# EAGLE design Cube_Mini_8x8x8_LED_Grid_08 (EAGLE 9.6.2)
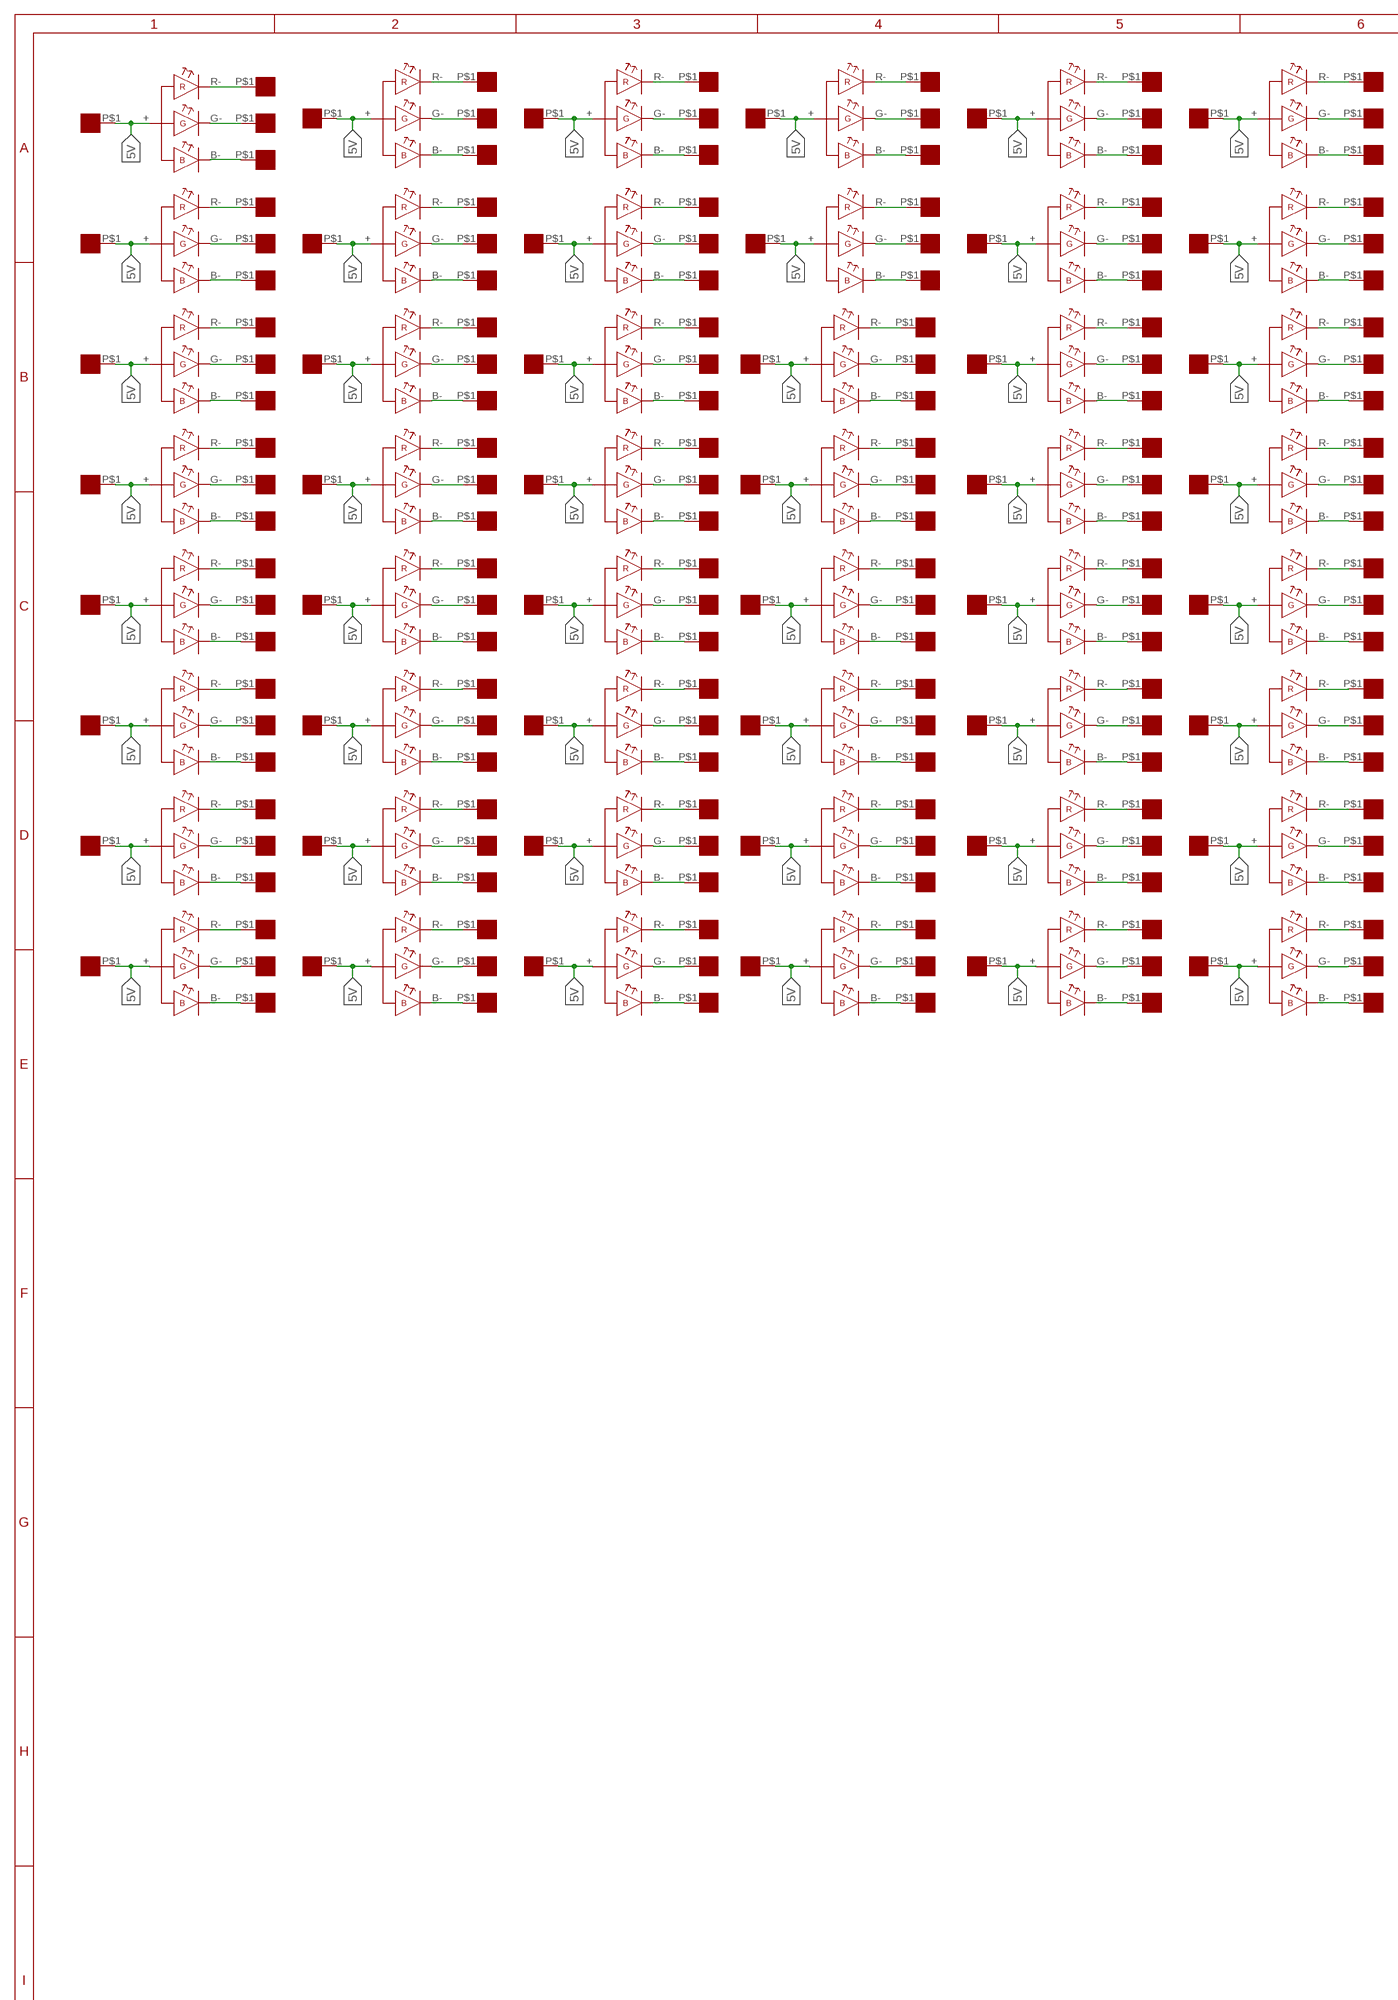
[diagram p0: schematic, sheet 1, part 1 of 2]
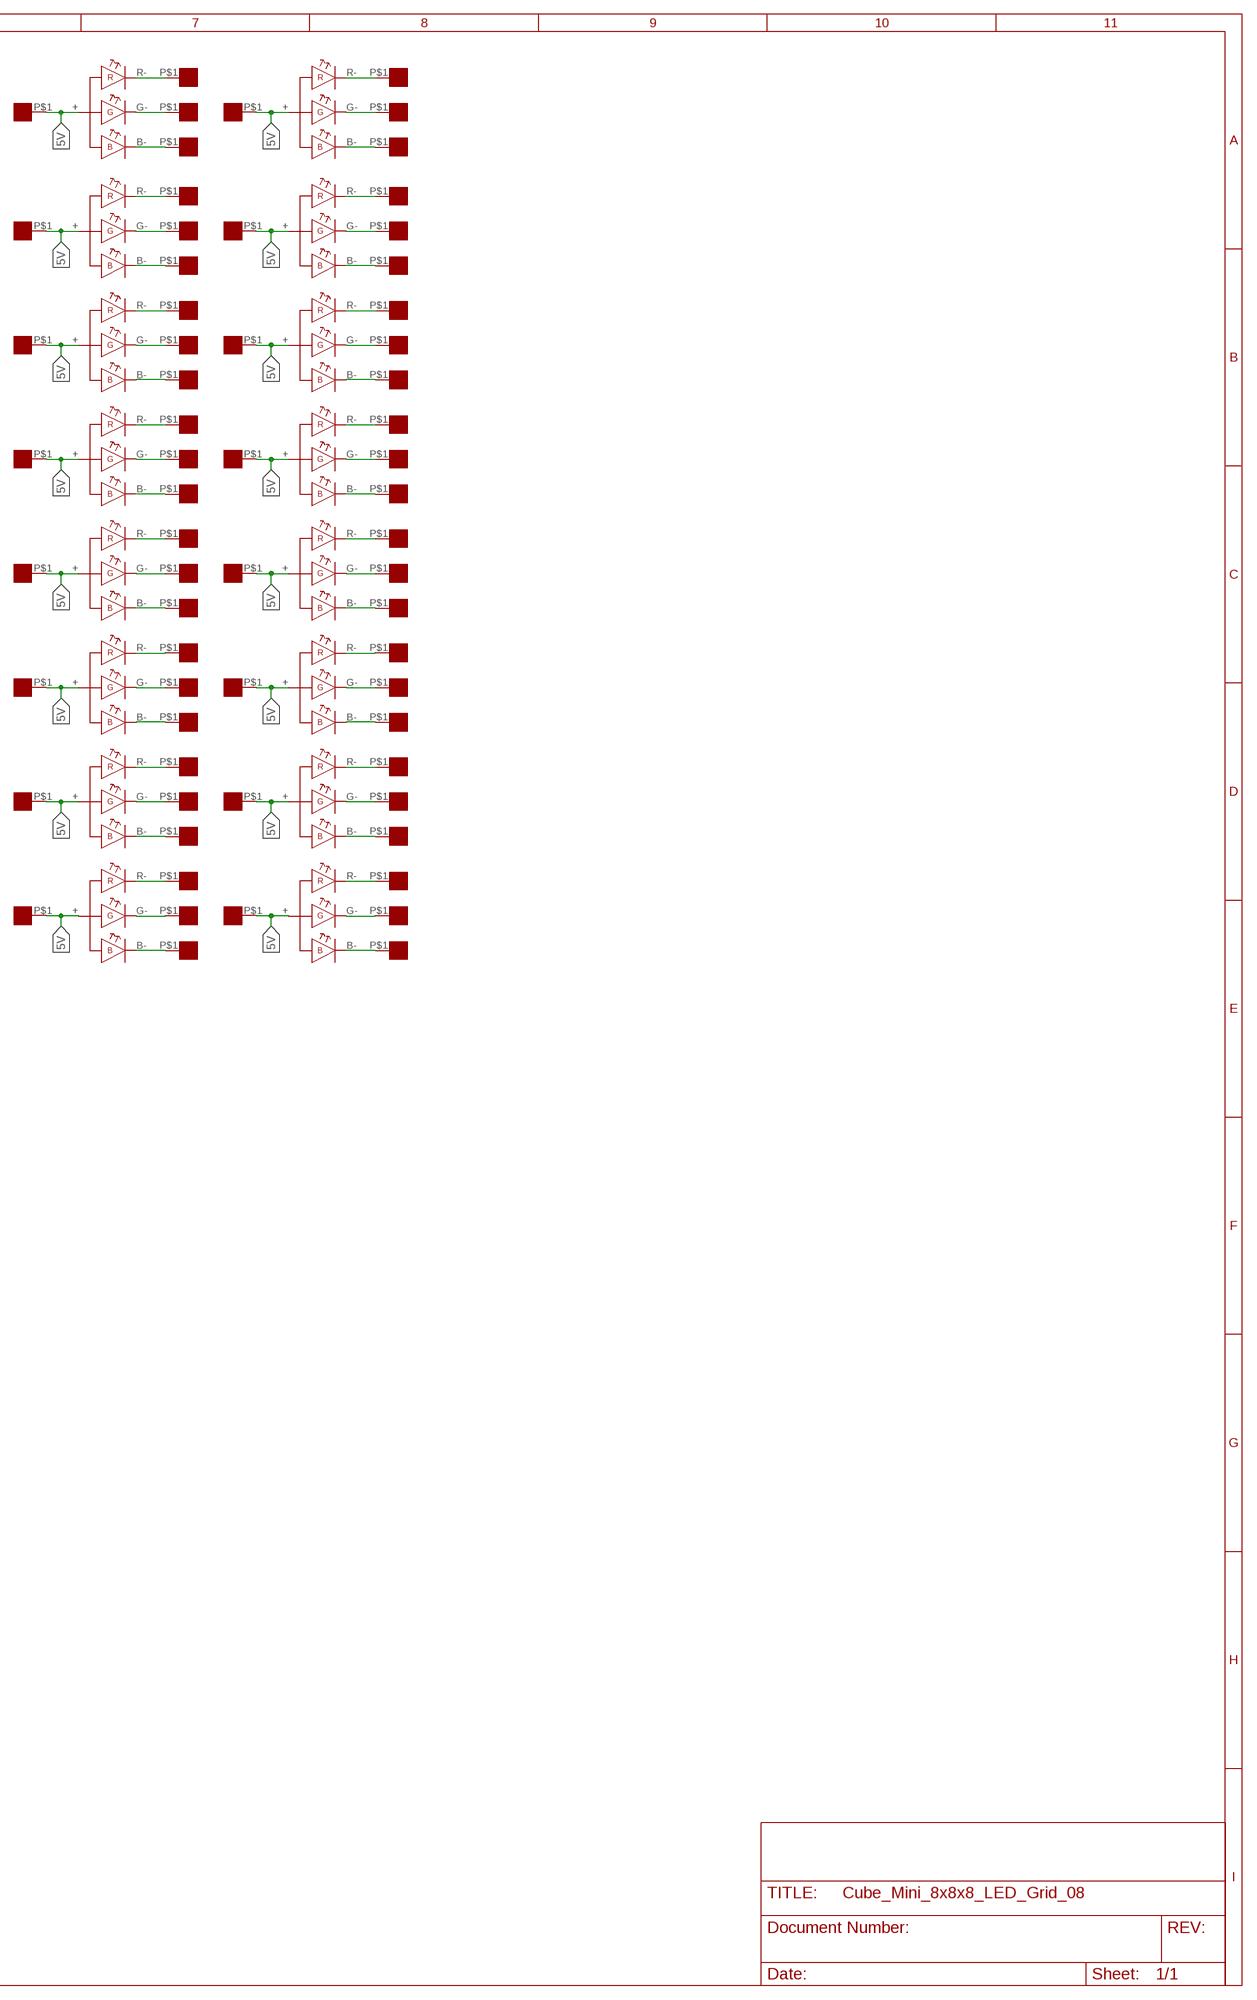
[diagram p1: schematic, sheet 1, part 2 of 2]

## Parts
5V$1  05X08PAD  [05X08PAD]
5V$2  05X08PAD  [05X08PAD]
5V$3  05X08PAD  [05X08PAD]
5V$4  05X08PAD  [05X08PAD]
5V$5  05X08PAD  [05X08PAD]
5V$6  05X08PAD  [05X08PAD]
5V$7  05X08PAD  [05X08PAD]
5V$8  05X08PAD  [05X08PAD]
5V$9  05X08PAD  [05X08PAD]
5V$10  05X08PAD  [05X08PAD]
5V$11  05X08PAD  [05X08PAD]
5V$12  05X08PAD  [05X08PAD]
5V$13  05X08PAD  [05X08PAD]
5V$14  05X08PAD  [05X08PAD]
5V$15  05X08PAD  [05X08PAD]
5V$16  05X08PAD  [05X08PAD]
5V$17  05X08PAD  [05X08PAD]
5V$18  05X08PAD  [05X08PAD]
5V$19  05X08PAD  [05X08PAD]
5V$20  05X08PAD  [05X08PAD]
5V$21  05X08PAD  [05X08PAD]
5V$22  05X08PAD  [05X08PAD]
5V$23  05X08PAD  [05X08PAD]
5V$24  05X08PAD  [05X08PAD]
5V$25  05X08PAD  [05X08PAD]
5V$26  05X08PAD  [05X08PAD]
5V$27  05X08PAD  [05X08PAD]
5V$28  05X08PAD  [05X08PAD]
5V$29  05X08PAD  [05X08PAD]
5V$30  05X08PAD  [05X08PAD]
5V$31  05X08PAD  [05X08PAD]
5V$32  05X08PAD  [05X08PAD]
5V$33  05X08PAD  [05X08PAD]
5V$34  05X08PAD  [05X08PAD]
5V$35  05X08PAD  [05X08PAD]
5V$36  05X08PAD  [05X08PAD]
5V$37  05X08PAD  [05X08PAD]
5V$38  05X08PAD  [05X08PAD]
5V$39  05X08PAD  [05X08PAD]
5V$40  05X08PAD  [05X08PAD]
5V$41  05X08PAD  [05X08PAD]
5V$42  05X08PAD  [05X08PAD]
5V$43  05X08PAD  [05X08PAD]
5V$44  05X08PAD  [05X08PAD]
5V$45  05X08PAD  [05X08PAD]
5V$46  05X08PAD  [05X08PAD]
5V$47  05X08PAD  [05X08PAD]
5V$48  05X08PAD  [05X08PAD]
5V$49  05X08PAD  [05X08PAD]
5V$50  05X08PAD  [05X08PAD]
5V$51  05X08PAD  [05X08PAD]
5V$52  05X08PAD  [05X08PAD]
5V$53  05X08PAD  [05X08PAD]
5V$54  05X08PAD  [05X08PAD]
5V$55  05X08PAD  [05X08PAD]
5V$56  05X08PAD  [05X08PAD]
5V$57  05X08PAD  [05X08PAD]
5V$58  05X08PAD  [05X08PAD]
5V$59  05X08PAD  [05X08PAD]
5V$60  05X08PAD  [05X08PAD]
5V$61  05X08PAD  [05X08PAD]
5V$62  05X08PAD  [05X08PAD]
5V$63  05X08PAD  [05X08PAD]
5V$64  05X08PAD  [05X08PAD]
B$1  05X08PAD  [05X08PAD]
B$2  05X08PAD  [05X08PAD]
B$3  05X08PAD  [05X08PAD]
B$4  05X08PAD  [05X08PAD]
B$5  05X08PAD  [05X08PAD]
B$6  05X08PAD  [05X08PAD]
B$7  05X08PAD  [05X08PAD]
B$8  05X08PAD  [05X08PAD]
B$9  05X08PAD  [05X08PAD]
B$10  05X08PAD  [05X08PAD]
B$11  05X08PAD  [05X08PAD]
B$12  05X08PAD  [05X08PAD]
B$13  05X08PAD  [05X08PAD]
B$14  05X08PAD  [05X08PAD]
B$15  05X08PAD  [05X08PAD]
B$16  05X08PAD  [05X08PAD]
B$17  05X08PAD  [05X08PAD]
B$18  05X08PAD  [05X08PAD]
B$19  05X08PAD  [05X08PAD]
B$20  05X08PAD  [05X08PAD]
B$21  05X08PAD  [05X08PAD]
B$22  05X08PAD  [05X08PAD]
B$23  05X08PAD  [05X08PAD]
B$24  05X08PAD  [05X08PAD]
B$25  05X08PAD  [05X08PAD]
B$26  05X08PAD  [05X08PAD]
B$27  05X08PAD  [05X08PAD]
B$28  05X08PAD  [05X08PAD]
B$29  05X08PAD  [05X08PAD]
B$30  05X08PAD  [05X08PAD]
B$31  05X08PAD  [05X08PAD]
B$32  05X08PAD  [05X08PAD]
B$33  05X08PAD  [05X08PAD]
B$34  05X08PAD  [05X08PAD]
B$35  05X08PAD  [05X08PAD]
B$36  05X08PAD  [05X08PAD]
B$37  05X08PAD  [05X08PAD]
B$38  05X08PAD  [05X08PAD]
B$39  05X08PAD  [05X08PAD]
B$40  05X08PAD  [05X08PAD]
B$41  05X08PAD  [05X08PAD]
B$42  05X08PAD  [05X08PAD]
B$43  05X08PAD  [05X08PAD]
B$44  05X08PAD  [05X08PAD]
B$45  05X08PAD  [05X08PAD]
B$46  05X08PAD  [05X08PAD]
B$47  05X08PAD  [05X08PAD]
B$48  05X08PAD  [05X08PAD]
B$49  05X08PAD  [05X08PAD]
B$50  05X08PAD  [05X08PAD]
B$51  05X08PAD  [05X08PAD]
B$52  05X08PAD  [05X08PAD]
B$53  05X08PAD  [05X08PAD]
B$54  05X08PAD  [05X08PAD]
B$55  05X08PAD  [05X08PAD]
B$56  05X08PAD  [05X08PAD]
B$57  05X08PAD  [05X08PAD]
B$58  05X08PAD  [05X08PAD]
B$59  05X08PAD  [05X08PAD]
B$60  05X08PAD  [05X08PAD]
B$61  05X08PAD  [05X08PAD]
B$62  05X08PAD  [05X08PAD]
B$63  05X08PAD  [05X08PAD]
B$64  05X08PAD  [05X08PAD]
G$1  05X08PAD  [05X08PAD]
G$2  05X08PAD  [05X08PAD]
G$3  05X08PAD  [05X08PAD]
G$4  05X08PAD  [05X08PAD]
G$5  05X08PAD  [05X08PAD]
G$6  05X08PAD  [05X08PAD]
G$7  05X08PAD  [05X08PAD]
G$8  05X08PAD  [05X08PAD]
G$9  05X08PAD  [05X08PAD]
G$10  05X08PAD  [05X08PAD]
G$11  05X08PAD  [05X08PAD]
G$12  05X08PAD  [05X08PAD]
G$13  05X08PAD  [05X08PAD]
G$14  05X08PAD  [05X08PAD]
G$15  05X08PAD  [05X08PAD]
G$16  05X08PAD  [05X08PAD]
G$17  05X08PAD  [05X08PAD]
G$18  05X08PAD  [05X08PAD]
G$19  05X08PAD  [05X08PAD]
G$20  05X08PAD  [05X08PAD]
G$21  05X08PAD  [05X08PAD]
G$22  05X08PAD  [05X08PAD]
G$23  05X08PAD  [05X08PAD]
G$24  05X08PAD  [05X08PAD]
G$25  05X08PAD  [05X08PAD]
G$26  05X08PAD  [05X08PAD]
G$27  05X08PAD  [05X08PAD]
G$28  05X08PAD  [05X08PAD]
G$29  05X08PAD  [05X08PAD]
G$30  05X08PAD  [05X08PAD]
G$31  05X08PAD  [05X08PAD]
G$32  05X08PAD  [05X08PAD]
G$33  05X08PAD  [05X08PAD]
G$34  05X08PAD  [05X08PAD]
G$35  05X08PAD  [05X08PAD]
G$36  05X08PAD  [05X08PAD]
G$37  05X08PAD  [05X08PAD]
G$38  05X08PAD  [05X08PAD]
G$39  05X08PAD  [05X08PAD]
G$40  05X08PAD  [05X08PAD]
G$41  05X08PAD  [05X08PAD]
G$42  05X08PAD  [05X08PAD]
G$43  05X08PAD  [05X08PAD]
G$44  05X08PAD  [05X08PAD]
G$45  05X08PAD  [05X08PAD]
G$46  05X08PAD  [05X08PAD]
G$47  05X08PAD  [05X08PAD]
G$48  05X08PAD  [05X08PAD]
G$49  05X08PAD  [05X08PAD]
G$50  05X08PAD  [05X08PAD]
G$51  05X08PAD  [05X08PAD]
G$52  05X08PAD  [05X08PAD]
G$53  05X08PAD  [05X08PAD]
G$54  05X08PAD  [05X08PAD]
G$55  05X08PAD  [05X08PAD]
G$56  05X08PAD  [05X08PAD]
G$57  05X08PAD  [05X08PAD]
G$58  05X08PAD  [05X08PAD]
G$59  05X08PAD  [05X08PAD]
G$60  05X08PAD  [05X08PAD]
G$61  05X08PAD  [05X08PAD]
G$62  05X08PAD  [05X08PAD]
G$63  05X08PAD  [05X08PAD]
G$64  05X08PAD  [05X08PAD]
R$1  05X08PAD  [05X08PAD]
R$2  05X08PAD  [05X08PAD]
R$3  05X08PAD  [05X08PAD]
R$4  05X08PAD  [05X08PAD]
R$5  05X08PAD  [05X08PAD]
R$6  05X08PAD  [05X08PAD]
R$7  05X08PAD  [05X08PAD]
R$8  05X08PAD  [05X08PAD]
R$9  05X08PAD  [05X08PAD]
R$10  05X08PAD  [05X08PAD]
R$11  05X08PAD  [05X08PAD]
R$12  05X08PAD  [05X08PAD]
R$13  05X08PAD  [05X08PAD]
R$14  05X08PAD  [05X08PAD]
R$15  05X08PAD  [05X08PAD]
R$16  05X08PAD  [05X08PAD]
R$17  05X08PAD  [05X08PAD]
R$18  05X08PAD  [05X08PAD]
R$19  05X08PAD  [05X08PAD]
R$20  05X08PAD  [05X08PAD]
R$21  05X08PAD  [05X08PAD]
R$22  05X08PAD  [05X08PAD]
R$23  05X08PAD  [05X08PAD]
R$24  05X08PAD  [05X08PAD]
R$25  05X08PAD  [05X08PAD]
R$26  05X08PAD  [05X08PAD]
R$27  05X08PAD  [05X08PAD]
R$28  05X08PAD  [05X08PAD]
R$29  05X08PAD  [05X08PAD]
R$30  05X08PAD  [05X08PAD]
R$31  05X08PAD  [05X08PAD]
R$32  05X08PAD  [05X08PAD]
R$33  05X08PAD  [05X08PAD]
R$34  05X08PAD  [05X08PAD]
R$35  05X08PAD  [05X08PAD]
R$36  05X08PAD  [05X08PAD]
R$37  05X08PAD  [05X08PAD]
R$38  05X08PAD  [05X08PAD]
R$39  05X08PAD  [05X08PAD]
R$40  05X08PAD  [05X08PAD]
R$41  05X08PAD  [05X08PAD]
R$42  05X08PAD  [05X08PAD]
R$43  05X08PAD  [05X08PAD]
R$44  05X08PAD  [05X08PAD]
R$45  05X08PAD  [05X08PAD]
R$46  05X08PAD  [05X08PAD]
R$47  05X08PAD  [05X08PAD]
R$48  05X08PAD  [05X08PAD]
R$49  05X08PAD  [05X08PAD]
R$50  05X08PAD  [05X08PAD]
R$51  05X08PAD  [05X08PAD]
R$52  05X08PAD  [05X08PAD]
R$53  05X08PAD  [05X08PAD]
R$54  05X08PAD  [05X08PAD]
R$55  05X08PAD  [05X08PAD]
R$56  05X08PAD  [05X08PAD]
R$57  05X08PAD  [05X08PAD]
R$58  05X08PAD  [05X08PAD]
R$59  05X08PAD  [05X08PAD]
R$60  05X08PAD  [05X08PAD]
R$61  05X08PAD  [05X08PAD]
R$62  05X08PAD  [05X08PAD]
R$63  05X08PAD  [05X08PAD]
R$64  05X08PAD  [05X08PAD]
U$1  B1010RGBT  [B1010RGBT]
U$2  B1010RGBT  [B1010RGBT]
U$3  B1010RGBT  [B1010RGBT]
U$4  B1010RGBT  [B1010RGBT]
U$5  B1010RGBT  [B1010RGBT]
U$6  B1010RGBT  [B1010RGBT]
U$7  B1010RGBT  [B1010RGBT]
U$8  B1010RGBT  [B1010RGBT]
U$9  B1010RGBT  [B1010RGBT]
U$10  B1010RGBT  [B1010RGBT]
U$11  B1010RGBT  [B1010RGBT]
U$12  B1010RGBT  [B1010RGBT]
U$13  B1010RGBT  [B1010RGBT]
U$14  B1010RGBT  [B1010RGBT]
U$15  B1010RGBT  [B1010RGBT]
U$16  B1010RGBT  [B1010RGBT]
U$17  B1010RGBT  [B1010RGBT]
U$18  B1010RGBT  [B1010RGBT]
U$19  B1010RGBT  [B1010RGBT]
U$20  B1010RGBT  [B1010RGBT]
U$21  B1010RGBT  [B1010RGBT]
U$22  B1010RGBT  [B1010RGBT]
U$23  B1010RGBT  [B1010RGBT]
U$24  B1010RGBT  [B1010RGBT]
U$25  B1010RGBT  [B1010RGBT]
U$26  B1010RGBT  [B1010RGBT]
U$27  B1010RGBT  [B1010RGBT]
U$28  B1010RGBT  [B1010RGBT]
U$29  B1010RGBT  [B1010RGBT]
U$30  B1010RGBT  [B1010RGBT]
U$31  B1010RGBT  [B1010RGBT]
U$32  B1010RGBT  [B1010RGBT]
U$33  B1010RGBT  [B1010RGBT]
U$34  B1010RGBT  [B1010RGBT]
U$35  B1010RGBT  [B1010RGBT]
U$36  B1010RGBT  [B1010RGBT]
U$37  B1010RGBT  [B1010RGBT]
U$38  B1010RGBT  [B1010RGBT]
U$39  B1010RGBT  [B1010RGBT]
U$40  B1010RGBT  [B1010RGBT]
U$41  B1010RGBT  [B1010RGBT]
U$42  B1010RGBT  [B1010RGBT]
U$43  B1010RGBT  [B1010RGBT]
U$44  B1010RGBT  [B1010RGBT]
U$45  B1010RGBT  [B1010RGBT]
U$46  B1010RGBT  [B1010RGBT]
U$47  B1010RGBT  [B1010RGBT]
U$48  B1010RGBT  [B1010RGBT]
U$49  B1010RGBT  [B1010RGBT]
U$50  B1010RGBT  [B1010RGBT]
U$51  B1010RGBT  [B1010RGBT]
U$52  B1010RGBT  [B1010RGBT]
U$53  B1010RGBT  [B1010RGBT]
U$54  B1010RGBT  [B1010RGBT]
U$55  B1010RGBT  [B1010RGBT]
U$56  B1010RGBT  [B1010RGBT]
U$57  B1010RGBT  [B1010RGBT]
U$58  B1010RGBT  [B1010RGBT]
U$59  B1010RGBT  [B1010RGBT]
U$60  B1010RGBT  [B1010RGBT]
U$61  B1010RGBT  [B1010RGBT]
U$62  B1010RGBT  [B1010RGBT]
U$63  B1010RGBT  [B1010RGBT]
U$64  B1010RGBT  [B1010RGBT]

## Nets
5V: 5V$1.P$1 5V$2.P$1 5V$3.P$1 5V$4.P$1 5V$5.P$1 5V$6.P$1 5V$7.P$1 5V$8.P$1 5V$9.P$1 5V$10.P$1 5V$11.P$1 5V$12.P$1 5V$13.P$1 5V$14.P$1 5V$15.P$1 5V$16.P$1 5V$17.P$1 5V$18.P$1 5V$19.P$1 5V$20.P$1 5V$21.P$1 5V$22.P$1 5V$23.P$1 5V$24.P$1 5V$25.P$1 5V$26.P$1 5V$27.P$1 5V$28.P$1 5V$29.P$1 5V$30.P$1 5V$31.P$1 5V$32.P$1 5V$33.P$1 5V$34.P$1 5V$35.P$1 5V$36.P$1 5V$37.P$1 5V$38.P$1 5V$39.P$1 5V$40.P$1 5V$41.P$1 5V$42.P$1 5V$43.P$1 5V$44.P$1 5V$45.P$1 5V$46.P$1 5V$47.P$1 5V$48.P$1 5V$49.P$1 5V$50.P$1 5V$51.P$1 5V$52.P$1 5V$53.P$1 5V$54.P$1 5V$55.P$1 5V$56.P$1 5V$57.P$1 5V$58.P$1 5V$59.P$1 5V$60.P$1 5V$61.P$1 5V$62.P$1 5V$63.P$1 5V$64.P$1 U$1.+ U$2.+ U$3.+ U$4.+ U$5.+ U$6.+ U$7.+ U$8.+ U$9.+ U$10.+ U$11.+ U$12.+ U$13.+ U$14.+ U$15.+ U$16.+ U$17.+ U$18.+ U$19.+ U$20.+ U$21.+ U$22.+ U$23.+ U$24.+ U$25.+ U$26.+ U$27.+ U$28.+ U$29.+ U$30.+ U$31.+ U$32.+ U$33.+ U$34.+ U$35.+ U$36.+ U$37.+ U$38.+ U$39.+ U$40.+ U$41.+ U$42.+ U$43.+ U$44.+ U$45.+ U$46.+ U$47.+ U$48.+ U$49.+ U$50.+ U$51.+ U$52.+ U$53.+ U$54.+ U$55.+ U$56.+ U$57.+ U$58.+ U$59.+ U$60.+ U$61.+ U$62.+ U$63.+ U$64.+
N$1: R$1.P$1 U$1.R-
N$2: G$1.P$1 U$1.G-
N$3: B$1.P$1 U$1.B-
N$7: R$2.P$1 U$2.R-
N$8: G$2.P$1 U$2.G-
N$9: B$2.P$1 U$2.B-
N$10: R$3.P$1 U$3.R-
N$11: G$3.P$1 U$3.G-
N$12: B$3.P$1 U$3.B-
N$13: R$5.P$1 U$5.R-
N$14: G$5.P$1 U$5.G-
N$15: B$5.P$1 U$5.B-
N$16: R$4.P$1 U$4.R-
N$17: G$4.P$1 U$4.G-
N$18: B$4.P$1 U$4.B-
N$19: R$7.P$1 U$7.R-
N$20: G$7.P$1 U$7.G-
N$21: B$7.P$1 U$7.B-
N$22: R$6.P$1 U$6.R-
N$23: G$6.P$1 U$6.G-
N$24: B$6.P$1 U$6.B-
N$25: R$9.P$1 U$9.R-
N$26: G$9.P$1 U$9.G-
N$27: B$9.P$1 U$9.B-
N$28: R$8.P$1 U$8.R-
N$29: G$8.P$1 U$8.G-
N$30: B$8.P$1 U$8.B-
N$31: R$11.P$1 U$11.R-
N$32: G$11.P$1 U$11.G-
N$33: B$11.P$1 U$11.B-
N$34: R$10.P$1 U$10.R-
N$35: G$10.P$1 U$10.G-
N$36: B$10.P$1 U$10.B-
N$37: R$12.P$1 U$12.R-
N$38: G$12.P$1 U$12.G-
N$39: B$12.P$1 U$12.B-
N$40: R$13.P$1 U$13.R-
N$41: G$13.P$1 U$13.G-
N$42: B$13.P$1 U$13.B-
N$43: R$14.P$1 U$14.R-
N$44: G$14.P$1 U$14.G-
N$45: B$14.P$1 U$14.B-
N$46: R$15.P$1 U$15.R-
N$47: G$15.P$1 U$15.G-
N$48: B$15.P$1 U$15.B-
N$49: R$16.P$1 U$16.R-
N$50: G$16.P$1 U$16.G-
N$51: B$16.P$1 U$16.B-
N$52: R$17.P$1 U$17.R-
N$53: G$17.P$1 U$17.G-
N$54: B$17.P$1 U$17.B-
N$55: R$18.P$1 U$18.R-
N$56: G$18.P$1 U$18.G-
N$57: B$18.P$1 U$18.B-
N$58: R$19.P$1 U$19.R-
N$59: G$19.P$1 U$19.G-
N$60: B$19.P$1 U$19.B-
N$61: R$20.P$1 U$20.R-
N$62: G$20.P$1 U$20.G-
N$63: B$20.P$1 U$20.B-
N$64: R$21.P$1 U$21.R-
N$65: G$21.P$1 U$21.G-
N$66: B$21.P$1 U$21.B-
N$67: R$22.P$1 U$22.R-
N$68: G$22.P$1 U$22.G-
N$69: B$22.P$1 U$22.B-
N$70: R$23.P$1 U$23.R-
N$71: G$23.P$1 U$23.G-
N$72: B$23.P$1 U$23.B-
N$73: R$24.P$1 U$24.R-
N$74: G$24.P$1 U$24.G-
N$75: B$24.P$1 U$24.B-
N$76: R$25.P$1 U$25.R-
N$77: G$25.P$1 U$25.G-
N$78: B$25.P$1 U$25.B-
N$79: R$26.P$1 U$26.R-
N$80: G$26.P$1 U$26.G-
N$81: B$26.P$1 U$26.B-
N$82: R$27.P$1 U$27.R-
N$83: G$27.P$1 U$27.G-
N$84: B$27.P$1 U$27.B-
N$85: R$28.P$1 U$28.R-
N$86: G$28.P$1 U$28.G-
N$87: B$28.P$1 U$28.B-
N$88: R$29.P$1 U$29.R-
N$89: G$29.P$1 U$29.G-
N$90: B$29.P$1 U$29.B-
N$91: R$30.P$1 U$30.R-
N$92: G$30.P$1 U$30.G-
N$93: B$30.P$1 U$30.B-
N$94: R$31.P$1 U$31.R-
N$95: G$31.P$1 U$31.G-
N$96: B$31.P$1 U$31.B-
N$97: R$32.P$1 U$32.R-
N$98: G$32.P$1 U$32.G-
N$99: B$32.P$1 U$32.B-
N$100: R$33.P$1 U$33.R-
N$101: G$33.P$1 U$33.G-
N$102: B$33.P$1 U$33.B-
N$103: R$34.P$1 U$34.R-
N$104: G$34.P$1 U$34.G-
N$105: B$34.P$1 U$34.B-
N$106: R$35.P$1 U$35.R-
N$107: G$35.P$1 U$35.G-
N$108: B$35.P$1 U$35.B-
N$109: R$36.P$1 U$36.R-
N$110: G$36.P$1 U$36.G-
N$111: B$36.P$1 U$36.B-
N$112: R$38.P$1 U$38.R-
N$113: G$38.P$1 U$38.G-
N$114: B$38.P$1 U$38.B-
N$115: R$37.P$1 U$37.R-
N$116: G$37.P$1 U$37.G-
N$117: B$37.P$1 U$37.B-
N$118: R$39.P$1 U$39.R-
N$119: G$39.P$1 U$39.G-
N$120: B$39.P$1 U$39.B-
N$121: R$40.P$1 U$40.R-
N$122: G$40.P$1 U$40.G-
N$123: B$40.P$1 U$40.B-
N$124: R$41.P$1 U$41.R-
N$125: G$41.P$1 U$41.G-
N$126: B$41.P$1 U$41.B-
N$127: R$42.P$1 U$42.R-
N$128: G$42.P$1 U$42.G-
N$129: B$42.P$1 U$42.B-
N$130: R$44.P$1 U$44.R-
N$131: G$44.P$1 U$44.G-
N$132: B$44.P$1 U$44.B-
N$133: R$43.P$1 U$43.R-
N$134: G$43.P$1 U$43.G-
N$135: B$43.P$1 U$43.B-
N$136: R$45.P$1 U$45.R-
N$137: G$45.P$1 U$45.G-
N$138: B$45.P$1 U$45.B-
N$139: R$46.P$1 U$46.R-
N$140: G$46.P$1 U$46.G-
N$141: B$46.P$1 U$46.B-
N$142: R$47.P$1 U$47.R-
N$143: G$47.P$1 U$47.G-
N$144: B$47.P$1 U$47.B-
N$145: R$48.P$1 U$48.R-
N$146: G$48.P$1 U$48.G-
N$147: B$48.P$1 U$48.B-
N$148: R$50.P$1 U$50.R-
N$149: G$50.P$1 U$50.G-
N$150: B$50.P$1 U$50.B-
N$151: R$49.P$1 U$49.R-
N$152: G$49.P$1 U$49.G-
N$153: B$49.P$1 U$49.B-
N$154: R$51.P$1 U$51.R-
N$155: G$51.P$1 U$51.G-
N$156: B$51.P$1 U$51.B-
N$157: R$53.P$1 U$53.R-
N$158: G$53.P$1 U$53.G-
N$159: B$53.P$1 U$53.B-
N$160: R$52.P$1 U$52.R-
N$161: G$52.P$1 U$52.G-
N$162: B$52.P$1 U$52.B-
N$163: R$54.P$1 U$54.R-
N$164: G$54.P$1 U$54.G-
N$165: B$54.P$1 U$54.B-
N$166: R$55.P$1 U$55.R-
N$167: G$55.P$1 U$55.G-
N$168: B$55.P$1 U$55.B-
N$169: R$56.P$1 U$56.R-
N$170: G$56.P$1 U$56.G-
N$171: B$56.P$1 U$56.B-
N$172: R$58.P$1 U$58.R-
N$173: G$58.P$1 U$58.G-
N$174: B$58.P$1 U$58.B-
N$175: R$57.P$1 U$57.R-
N$176: G$57.P$1 U$57.G-
N$177: B$57.P$1 U$57.B-
N$178: R$59.P$1 U$59.R-
N$179: G$59.P$1 U$59.G-
N$180: B$59.P$1 U$59.B-
N$181: R$60.P$1 U$60.R-
N$182: G$60.P$1 U$60.G-
N$183: B$60.P$1 U$60.B-
N$184: R$61.P$1 U$61.R-
N$185: G$61.P$1 U$61.G-
N$186: B$61.P$1 U$61.B-
N$187: R$62.P$1 U$62.R-
N$188: G$62.P$1 U$62.G-
N$189: B$62.P$1 U$62.B-
N$190: R$63.P$1 U$63.R-
N$191: G$63.P$1 U$63.G-
N$192: B$63.P$1 U$63.B-
N$193: R$64.P$1 U$64.R-
N$194: G$64.P$1 U$64.G-
N$195: B$64.P$1 U$64.B-

## Library data of the parts
5V$1-5V$64 B$1-B$64 G$1-G$64 R$1-R$64 = XXxYYPAD:05X08PAD
U$1-U$64 = B1010RGBT:B1010RGBT

## Board
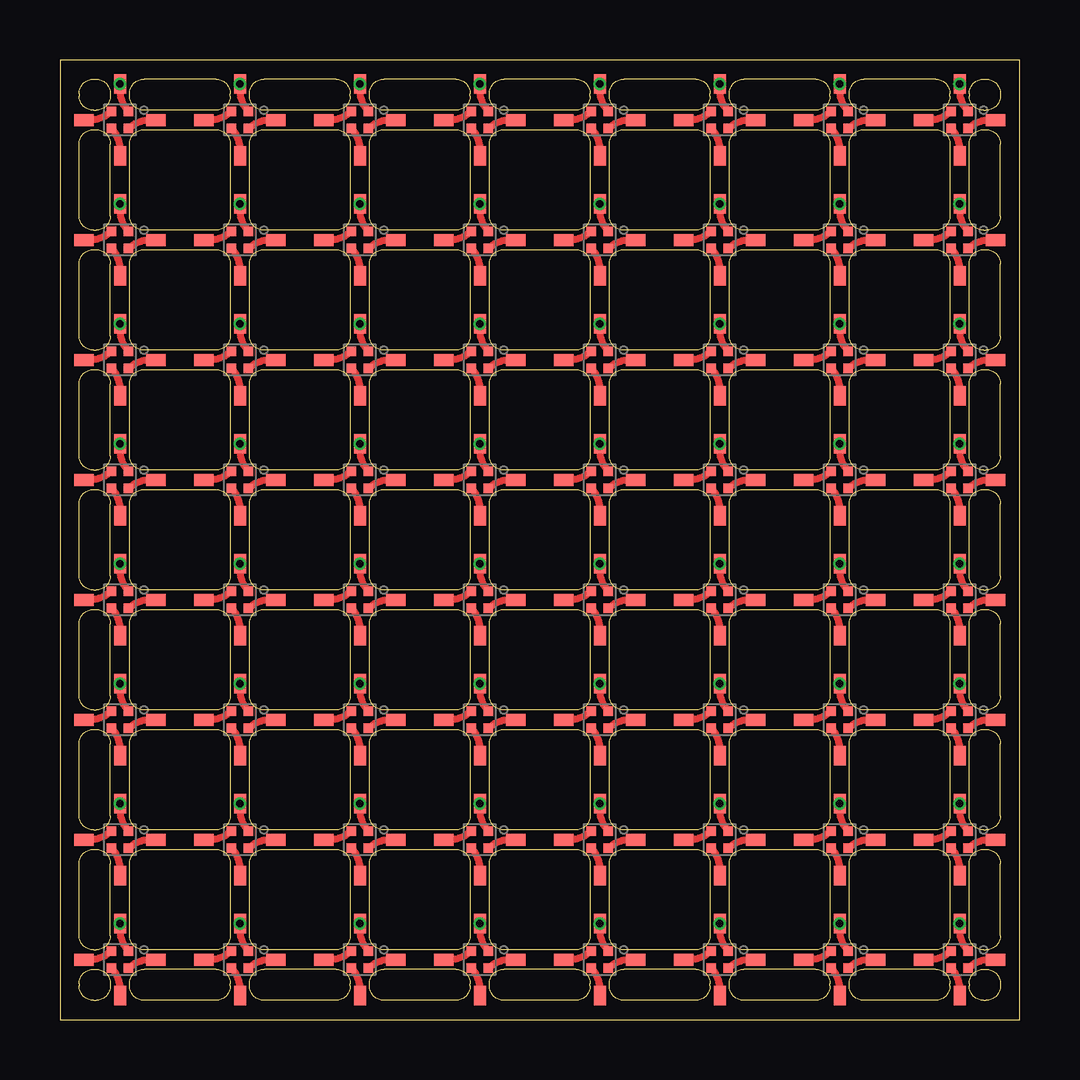
[diagram p2: board, top side]
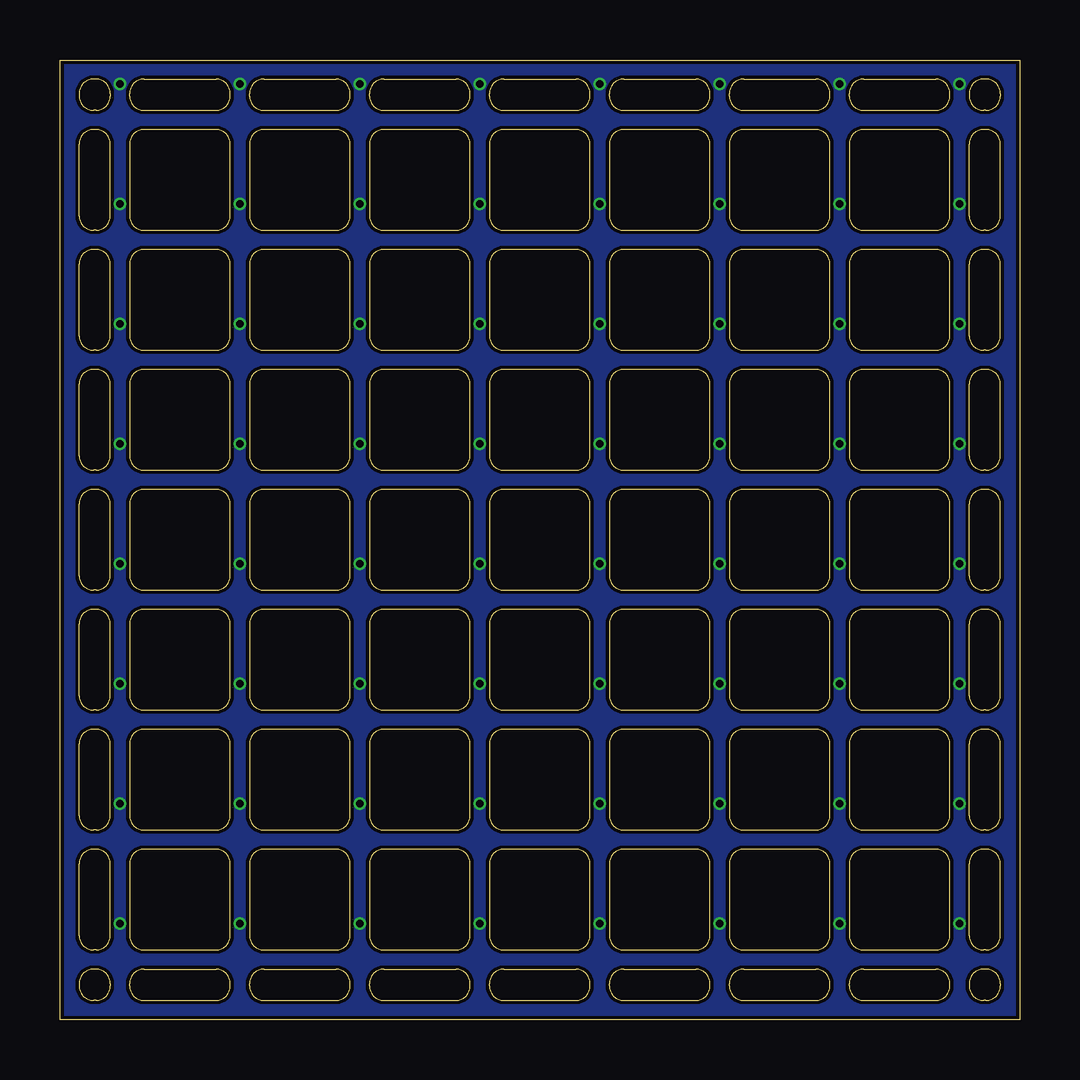
[diagram p3: board, bottom side, seen from below]

Size 40 x 40 mm. Coordinates in mm from the lower left corner, seen from the top.
Outline: 652 segments
Copper layers (1*16): Top 0.035mm / dielectric 1.5mm / Bottom 0.035mm
Design rules "reglejlcpcb *": minimum track width 5mil, minimum drill 0.3mm, track to track 5mil, track to pad 5mil, pad to pad 5mil, via to via 5mil, smd to smd 5mil, copper to edge 0.15mm, drill to drill 0.5mm, minimum pad ring 10mil, minimum via ring 0.1mm, stop-mask expansion 4mil, vias tented up to drill 0mil, thermal gap 10mil

### Footprints (pad centres in the part's own frame; a part is rotated, then mirrored left to right if it is on the bottom)
05X08PAD = smd 0.5 x 0.8: P$1 0,0
B1010RGBT = smd 0.4 x 0.4: + 0.36,0.36; B- -0.36,0.36; G- -0.36,-0.36; R- 0.36,-0.36

### Placement (x,y rotation side)
5V$1  2.5,4 0 top
5V$2  7.5,4 0 top
5V$3  12.5,4 0 top
5V$4  17.5,4 0 top
5V$5  22.5,4 0 top
5V$6  27.5,4 0 top
5V$7  32.5,4 0 top
5V$8  37.5,4 0 top
5V$9  2.5,9 0 top
5V$10  7.5,9 0 top
5V$11  12.5,9 0 top
5V$12  17.5,9 0 top
5V$13  22.5,9 0 top
5V$14  27.5,9 0 top
5V$15  32.5,9 0 top
5V$16  37.5,9 0 top
5V$17  2.5,14 0 top
5V$18  7.5,14 0 top
5V$19  12.5,14 0 top
5V$20  17.5,14 0 top
5V$21  22.5,14 0 top
5V$22  27.5,14 0 top
5V$23  32.5,14 0 top
5V$24  37.5,14 0 top
5V$25  2.5,19 0 top
5V$26  7.5,19 0 top
5V$27  12.5,19 0 top
5V$28  17.5,19 0 top
5V$29  22.5,19 0 top
5V$30  27.5,19 0 top
5V$31  32.5,19 0 top
5V$32  37.5,19 0 top
5V$33  2.5,24 0 top
5V$34  7.5,24 0 top
5V$35  12.5,24 0 top
5V$36  17.5,24 0 top
5V$37  22.5,24 0 top
5V$38  27.5,24 0 top
5V$39  32.5,24 0 top
5V$40  37.5,24 0 top
5V$41  2.5,29 0 top
5V$42  7.5,29 0 top
5V$43  12.5,29 0 top
5V$44  17.5,29 0 top
5V$45  22.5,29 0 top
5V$46  27.5,29 0 top
5V$47  32.5,29 0 top
5V$48  37.5,29 0 top
5V$49  2.5,34 0 top
5V$50  7.5,34 0 top
5V$51  12.5,34 0 top
5V$52  17.5,34 0 top
5V$53  22.5,34 0 top
5V$54  27.5,34 0 top
5V$55  32.5,34 0 top
5V$56  37.5,34 0 top
5V$57  2.5,39 0 top
5V$58  7.5,39 0 top
5V$59  12.5,39 0 top
5V$60  17.5,39 0 top
5V$61  22.5,39 0 top
5V$62  27.5,39 0 top
5V$63  32.5,39 0 top
5V$64  37.5,39 0 top
B$1  1,2.5 90 top
B$2  6,2.5 90 top
B$3  11,2.5 90 top
B$4  16,2.5 90 top
B$5  21,2.5 90 top
B$6  26,2.5 90 top
B$7  31,2.5 90 top
B$8  36,2.5 90 top
B$9  1,7.5 90 top
B$10  6,7.5 90 top
B$11  11,7.5 90 top
B$12  16,7.5 90 top
B$13  21,7.5 90 top
B$14  26,7.5 90 top
B$15  31,7.5 90 top
B$16  36,7.5 90 top
B$17  1,12.5 90 top
B$18  6,12.5 90 top
B$19  11,12.5 90 top
B$20  16,12.5 90 top
B$21  21,12.5 90 top
B$22  26,12.5 90 top
B$23  31,12.5 90 top
B$24  36,12.5 90 top
B$25  1,17.5 90 top
B$26  6,17.5 90 top
B$27  11,17.5 90 top
B$28  16,17.5 90 top
B$29  21,17.5 90 top
B$30  26,17.5 90 top
B$31  31,17.5 90 top
B$32  36,17.5 90 top
B$33  1,22.5 90 top
B$34  6,22.5 90 top
B$35  11,22.5 90 top
B$36  16,22.5 90 top
B$37  21,22.5 90 top
B$38  26,22.5 90 top
B$39  31,22.5 90 top
B$40  36,22.5 90 top
B$41  1,27.5 90 top
B$42  6,27.5 90 top
B$43  11,27.5 90 top
B$44  16,27.5 90 top
B$45  21,27.5 90 top
B$46  26,27.5 90 top
B$47  31,27.5 90 top
B$48  36,27.5 90 top
B$49  1,32.5 90 top
B$50  6,32.5 90 top
B$51  11,32.5 90 top
B$52  16,32.5 90 top
B$53  21,32.5 90 top
B$54  26,32.5 90 top
B$55  31,32.5 90 top
B$56  36,32.5 90 top
B$57  1,37.5 90 top
B$58  6,37.5 90 top
B$59  11,37.5 90 top
B$60  16,37.5 90 top
B$61  21,37.5 90 top
B$62  26,37.5 90 top
B$63  31,37.5 90 top
B$64  36,37.5 90 top
G$1  2.5,1 0 top
G$2  7.5,1 0 top
G$3  12.5,1 0 top
G$4  17.5,1 0 top
G$5  22.5,1 0 top
G$6  27.5,1 0 top
G$7  32.5,1 0 top
G$8  37.5,1 0 top
G$9  2.5,6 0 top
G$10  7.5,6 0 top
G$11  12.5,6 0 top
G$12  17.5,6 0 top
G$13  22.5,6 0 top
G$14  27.5,6 0 top
G$15  32.5,6 0 top
G$16  37.5,6 0 top
G$17  2.5,11 0 top
G$18  7.5,11 0 top
G$19  12.5,11 0 top
G$20  17.5,11 0 top
G$21  22.5,11 0 top
G$22  27.5,11 0 top
G$23  32.5,11 0 top
G$24  37.5,11 0 top
G$25  2.5,16 0 top
G$26  7.5,16 0 top
G$27  12.5,16 0 top
G$28  17.5,16 0 top
G$29  22.5,16 0 top
G$30  27.5,16 0 top
G$31  32.5,16 0 top
G$32  37.5,16 0 top
G$33  2.5,21 0 top
G$34  7.5,21 0 top
G$35  12.5,21 0 top
G$36  17.5,21 0 top
G$37  22.5,21 0 top
G$38  27.5,21 0 top
G$39  32.5,21 0 top
G$40  37.5,21 0 top
G$41  2.5,26 0 top
G$42  7.5,26 0 top
G$43  12.5,26 0 top
G$44  17.5,26 0 top
G$45  22.5,26 0 top
G$46  27.5,26 0 top
G$47  32.5,26 0 top
G$48  37.5,26 0 top
G$49  2.5,31 0 top
G$50  7.5,31 0 top
G$51  12.5,31 0 top
G$52  17.5,31 0 top
G$53  22.5,31 0 top
G$54  27.5,31 0 top
G$55  32.5,31 0 top
G$56  37.5,31 0 top
G$57  2.5,36 0 top
G$58  7.5,36 0 top
G$59  12.5,36 0 top
G$60  17.5,36 0 top
G$61  22.5,36 0 top
G$62  27.5,36 0 top
G$63  32.5,36 0 top
G$64  37.5,36 0 top
R$1  4,2.5 90 top
R$2  9,2.5 90 top
R$3  14,2.5 90 top
R$4  19,2.5 90 top
R$5  24,2.5 90 top
R$6  29,2.5 90 top
R$7  34,2.5 90 top
R$8  39,2.5 90 top
R$9  4,7.5 90 top
R$10  9,7.5 90 top
R$11  14,7.5 90 top
R$12  19,7.5 90 top
R$13  24,7.5 90 top
R$14  29,7.5 90 top
R$15  34,7.5 90 top
R$16  39,7.5 90 top
R$17  4,12.5 90 top
R$18  9,12.5 90 top
R$19  14,12.5 90 top
R$20  19,12.5 90 top
R$21  24,12.5 90 top
R$22  29,12.5 90 top
R$23  34,12.5 90 top
R$24  39,12.5 90 top
R$25  4,17.5 90 top
R$26  9,17.5 90 top
R$27  14,17.5 90 top
R$28  19,17.5 90 top
R$29  24,17.5 90 top
R$30  29,17.5 90 top
R$31  34,17.5 90 top
R$32  39,17.5 90 top
R$33  4,22.5 90 top
R$34  9,22.5 90 top
R$35  14,22.5 90 top
R$36  19,22.5 90 top
R$37  24,22.5 90 top
R$38  29,22.5 90 top
R$39  34,22.5 90 top
R$40  39,22.5 90 top
R$41  4,27.5 90 top
R$42  9,27.5 90 top
R$43  14,27.5 90 top
R$44  19,27.5 90 top
R$45  24,27.5 90 top
R$46  29,27.5 90 top
R$47  34,27.5 90 top
R$48  39,27.5 90 top
R$49  4,32.5 90 top
R$50  9,32.5 90 top
R$51  14,32.5 90 top
R$52  19,32.5 90 top
R$53  24,32.5 90 top
R$54  29,32.5 90 top
R$55  34,32.5 90 top
R$56  39,32.5 90 top
R$57  4,37.5 90 top
R$58  9,37.5 90 top
R$59  14,37.5 90 top
R$60  19,37.5 90 top
R$61  24,37.5 90 top
R$62  29,37.5 90 top
R$63  34,37.5 90 top
R$64  39,37.5 90 top
U$1  2.5,2.5 0 top
U$2  7.5,2.5 0 top
U$3  12.5,2.5 0 top
U$4  17.5,2.5 0 top
U$5  22.5,2.5 0 top
U$6  27.5,2.5 0 top
U$7  32.5,2.5 0 top
U$8  37.5,2.5 0 top
U$9  2.5,7.5 0 top
U$10  7.5,7.5 0 top
U$11  12.5,7.5 0 top
U$12  17.5,7.5 0 top
U$13  22.5,7.5 0 top
U$14  27.5,7.5 0 top
U$15  32.5,7.5 0 top
U$16  37.5,7.5 0 top
U$17  2.5,12.5 0 top
U$18  7.5,12.5 0 top
U$19  12.5,12.5 0 top
U$20  17.5,12.5 0 top
U$21  22.5,12.5 0 top
U$22  27.5,12.5 0 top
U$23  32.5,12.5 0 top
U$24  37.5,12.5 0 top
U$25  2.5,17.5 0 top
U$26  7.5,17.5 0 top
U$27  12.5,17.5 0 top
U$28  17.5,17.5 0 top
U$29  22.5,17.5 0 top
U$30  27.5,17.5 0 top
U$31  32.5,17.5 0 top
U$32  37.5,17.5 0 top
U$33  2.5,22.5 0 top
U$34  7.5,22.5 0 top
U$35  12.5,22.5 0 top
U$36  17.5,22.5 0 top
U$37  22.5,22.5 0 top
U$38  27.5,22.5 0 top
U$39  32.5,22.5 0 top
U$40  37.5,22.5 0 top
U$41  2.5,27.5 0 top
U$42  7.5,27.5 0 top
U$43  12.5,27.5 0 top
U$44  17.5,27.5 0 top
U$45  22.5,27.5 0 top
U$46  27.5,27.5 0 top
U$47  32.5,27.5 0 top
U$48  37.5,27.5 0 top
U$49  2.5,32.5 0 top
U$50  7.5,32.5 0 top
U$51  12.5,32.5 0 top
U$52  17.5,32.5 0 top
U$53  22.5,32.5 0 top
U$54  27.5,32.5 0 top
U$55  32.5,32.5 0 top
U$56  37.5,32.5 0 top
U$57  2.5,37.5 0 top
U$58  7.5,37.5 0 top
U$59  12.5,37.5 0 top
U$60  17.5,37.5 0 top
U$61  22.5,37.5 0 top
U$62  27.5,37.5 0 top
U$63  32.5,37.5 0 top
U$64  37.5,37.5 0 top

### Tracks (layer width: path | path; a pad name or v marks a point on that pad's centre or on a via)
5V  (via drill 0.3 pad 0.5)
  Top 0.3: 5V$1.P$1 2.5,3.73 arc45 U$1.+ | 5V$2.P$1 7.5,3.73 arc45 U$2.+ | 5V$3.P$1 12.5,3.73 arc45 U$3.+ | 5V$4.P$1 17.5,3.73 arc45 U$4.+ | 5V$5.P$1 22.5,3.73 arc45 U$5.+ | 5V$6.P$1 27.5,3.73 arc45 U$6.+ | 5V$7.P$1 32.5,3.73 arc45 U$7.+ | 5V$8.P$1 37.5,3.73 arc45 U$8.+ | 5V$9.P$1 2.5,8.73 arc45 U$9.+ | 5V$10.P$1 7.5,8.73 arc45 U$10.+ | 5V$11.P$1 12.5,8.73 arc45 U$11.+ | 5V$12.P$1 17.5,8.73 arc45 U$12.+ | 5V$13.P$1 22.5,8.73 arc45 U$13.+ | 5V$14.P$1 27.5,8.73 arc45 U$14.+ | 5V$15.P$1 32.5,8.73 arc45 U$15.+ | 5V$16.P$1 37.5,8.73 arc45 U$16.+ | 5V$17.P$1 2.5,13.73 arc45 U$17.+ | 5V$18.P$1 7.5,13.73 arc45 U$18.+ | 5V$19.P$1 12.5,13.73 arc45 U$19.+ | 5V$20.P$1 17.5,13.73 arc45 U$20.+ | 5V$21.P$1 22.5,13.73 arc45 U$21.+ | 5V$22.P$1 27.5,13.73 arc45 U$22.+ | 5V$23.P$1 32.5,13.73 arc45 U$23.+ | 5V$24.P$1 37.5,13.73 arc45 U$24.+ | 5V$25.P$1 2.5,18.73 arc45 U$25.+ | 5V$26.P$1 7.5,18.73 arc45 U$26.+ | 5V$27.P$1 12.5,18.73 arc45 U$27.+ | 5V$28.P$1 17.5,18.73 arc45 U$28.+ | 5V$29.P$1 22.5,18.73 arc45 U$29.+ | 5V$30.P$1 27.5,18.73 arc45 U$30.+ | 5V$31.P$1 32.5,18.73 arc45 U$31.+ | 5V$32.P$1 37.5,18.73 arc45 U$32.+ | 5V$33.P$1 2.5,23.73 arc45 U$33.+ | 5V$34.P$1 7.5,23.73 arc45 U$34.+ | 5V$35.P$1 12.5,23.73 arc45 U$35.+ | 5V$36.P$1 17.5,23.73 arc45 U$36.+ | 5V$37.P$1 22.5,23.73 arc45 U$37.+ | 5V$38.P$1 27.5,23.73 arc45 U$38.+ | 5V$39.P$1 32.5,23.73 arc45 U$39.+ | 5V$40.P$1 37.5,23.73 arc45 U$40.+ | 5V$41.P$1 2.5,28.73 arc45 U$41.+ | 5V$42.P$1 7.5,28.73 arc45 U$42.+ | 5V$43.P$1 12.5,28.73 arc45 U$43.+ | 5V$44.P$1 17.5,28.73 arc45 U$44.+ | 5V$45.P$1 22.5,28.73 arc45 U$45.+ | 5V$46.P$1 27.5,28.73 arc45 U$46.+ | 5V$47.P$1 32.5,28.73 arc45 U$47.+
  Top 0.3: 5V$48.P$1 37.5,28.73 arc45 U$48.+ | 5V$49.P$1 2.5,33.73 arc45 U$49.+ | 5V$50.P$1 7.5,33.73 arc45 U$50.+ | 5V$51.P$1 12.5,33.73 arc45 U$51.+ | 5V$52.P$1 17.5,33.73 arc45 U$52.+ | 5V$53.P$1 22.5,33.73 arc45 U$53.+ | 5V$54.P$1 27.5,33.73 arc45 U$54.+ | 5V$55.P$1 32.5,33.73 arc45 U$55.+ | 5V$56.P$1 37.5,33.73 arc45 U$56.+ | 5V$57.P$1 2.5,38.73 arc45 U$57.+ | 5V$58.P$1 7.5,38.73 arc45 U$58.+ | 5V$59.P$1 12.5,38.73 arc45 U$59.+ | 5V$60.P$1 17.5,38.73 arc45 U$60.+ | 5V$61.P$1 22.5,38.73 arc45 U$61.+ | 5V$62.P$1 27.5,38.73 arc45 U$62.+ | 5V$63.P$1 32.5,38.73 arc45 U$63.+ | 5V$64.P$1 37.5,38.73 arc45 U$64.+
  other vias: 2.5,4 7.5,4 12.5,4 17.5,4 22.5,4 27.5,4 32.5,4 37.5,4 37.5,9 32.5,9 27.5,9 22.5,9 17.5,9 12.5,9 7.5,9 2.5,9 2.5,14 7.5,14 12.5,14 17.5,14 22.5,14 27.5,14 32.5,14 37.5,14 37.5,19 32.5,19 27.5,19 17.5,19 22.5,19 12.5,19 7.5,19 2.5,19 2.5,24 7.5,24 12.5,24 17.5,24 22.5,24 27.5,24 32.5,24 37.5,24 37.5,29 27.5,29 32.5,29 17.5,29 22.5,29 7.5,29 12.5,29 2.5,29 2.5,34 7.5,34 12.5,34 17.5,34 22.5,34 27.5,34 32.5,34 37.5,34 37.5,39 32.5,39 27.5,39 22.5,39 17.5,39 12.5,39 2.5,39 7.5,39
  pour Bottom: -3.5,-3.5 -3.5,43.6 43.5,43.6 43.5,-3.5
N$1
  Top 0.3: U$1.R- arc-45 3.73,2.5 R$1.P$1
N$2
  Top 0.3: U$1.G- arc-45 2.5,1.27 G$1.P$1
N$3
  Top 0.3: U$1.B- arc-45 1.27,2.5 B$1.P$1
N$7
  Top 0.3: U$2.R- arc-45 8.73,2.5 R$2.P$1
N$8
  Top 0.3: U$2.G- arc-45 7.5,1.27 G$2.P$1
N$9
  Top 0.3: U$2.B- arc-45 6.27,2.5 B$2.P$1
N$10
  Top 0.3: U$3.R- arc-45 13.73,2.5 R$3.P$1
N$11
  Top 0.3: U$3.G- arc-45 12.5,1.27 G$3.P$1
N$12
  Top 0.3: U$3.B- arc-45 11.27,2.5 B$3.P$1
N$13
  Top 0.3: U$5.R- arc-45 23.73,2.5 R$5.P$1
N$14
  Top 0.3: U$5.G- arc-45 22.5,1.27 G$5.P$1
N$15
  Top 0.3: U$5.B- arc-45 21.27,2.5 B$5.P$1
N$16
  Top 0.3: U$4.R- arc-45 18.73,2.5 R$4.P$1
N$17
  Top 0.3: U$4.G- arc-45 17.5,1.27 G$4.P$1
N$18
  Top 0.3: U$4.B- arc-45 16.27,2.5 B$4.P$1
N$19
  Top 0.3: U$7.R- arc-45 33.73,2.5 R$7.P$1
N$20
  Top 0.3: U$7.G- arc-45 32.5,1.27 G$7.P$1
N$21
  Top 0.3: U$7.B- arc-45 31.27,2.5 B$7.P$1
N$22
  Top 0.3: U$6.R- arc-45 28.73,2.5 R$6.P$1
N$23
  Top 0.3: U$6.G- arc-45 27.5,1.27 G$6.P$1
N$24
  Top 0.3: U$6.B- arc-45 26.27,2.5 B$6.P$1
N$25
  Top 0.3: U$9.R- arc-45 3.73,7.5 R$9.P$1
N$26
  Top 0.3: U$9.G- arc-45 2.5,6.27 G$9.P$1
N$27
  Top 0.3: U$9.B- arc-45 1.27,7.5 B$9.P$1
N$28
  Top 0.3: U$8.R- arc-45 38.73,2.5 R$8.P$1
N$29
  Top 0.3: U$8.G- arc-45 37.5,1.27 G$8.P$1
N$30
  Top 0.3: U$8.B- arc-45 36.27,2.5 B$8.P$1
N$31
  Top 0.3: U$11.R- arc-45 13.73,7.5 R$11.P$1
N$32
  Top 0.3: U$11.G- arc-45 12.5,6.27 G$11.P$1
N$33
  Top 0.3: U$11.B- arc-45 11.27,7.5 B$11.P$1
N$34
  Top 0.3: U$10.R- arc-45 8.73,7.5 R$10.P$1
N$35
  Top 0.3: U$10.G- arc-45 7.5,6.27 G$10.P$1
N$36
  Top 0.3: U$10.B- arc-45 6.27,7.5 B$10.P$1
N$37
  Top 0.3: U$12.R- arc-45 18.73,7.5 R$12.P$1
N$38
  Top 0.3: U$12.G- arc-45 17.5,6.27 G$12.P$1
N$39
  Top 0.3: U$12.B- arc-45 16.27,7.5 B$12.P$1
N$40
  Top 0.3: U$13.R- arc-45 23.73,7.5 R$13.P$1
N$41
  Top 0.3: U$13.G- arc-45 22.5,6.27 G$13.P$1
N$42
  Top 0.3: U$13.B- arc-45 21.27,7.5 B$13.P$1
N$43
  Top 0.3: U$14.R- arc-45 28.73,7.5 R$14.P$1
N$44
  Top 0.3: U$14.G- arc-45 27.5,6.27 G$14.P$1
N$45
  Top 0.3: U$14.B- arc-45 26.27,7.5 B$14.P$1
N$46
  Top 0.3: U$15.R- arc-45 33.73,7.5 R$15.P$1
N$47
  Top 0.3: U$15.G- arc-45 32.5,6.27 G$15.P$1
N$48
  Top 0.3: U$15.B- arc-45 31.27,7.5 B$15.P$1
N$49
  Top 0.3: U$16.R- arc-45 38.73,7.5 R$16.P$1
N$50
  Top 0.3: U$16.G- arc-45 37.5,6.27 G$16.P$1
N$51
  Top 0.3: U$16.B- arc-45 36.27,7.5 B$16.P$1
N$52
  Top 0.3: U$17.R- arc-45 3.73,12.5 R$17.P$1
N$53
  Top 0.3: U$17.G- arc-45 2.5,11.27 G$17.P$1
N$54
  Top 0.3: U$17.B- arc-45 1.27,12.5 B$17.P$1
N$55
  Top 0.3: U$18.R- arc-45 8.73,12.5 R$18.P$1
N$56
  Top 0.3: U$18.G- arc-45 7.5,11.27 G$18.P$1
N$57
  Top 0.3: U$18.B- arc-45 6.27,12.5 B$18.P$1
N$58
  Top 0.3: U$19.R- arc-45 13.73,12.5 R$19.P$1
N$59
  Top 0.3: U$19.G- arc-45 12.5,11.27 G$19.P$1
N$60
  Top 0.3: U$19.B- arc-45 11.27,12.5 B$19.P$1
N$61
  Top 0.3: U$20.R- arc-45 18.73,12.5 R$20.P$1
N$62
  Top 0.3: U$20.G- arc-45 17.5,11.27 G$20.P$1
N$63
  Top 0.3: U$20.B- arc-45 16.27,12.5 B$20.P$1
N$64
  Top 0.3: U$21.R- arc-45 23.73,12.5 R$21.P$1
N$65
  Top 0.3: U$21.G- arc-45 22.5,11.27 G$21.P$1
N$66
  Top 0.3: U$21.B- arc-45 21.27,12.5 B$21.P$1
N$67
  Top 0.3: U$22.R- arc-45 28.73,12.5 R$22.P$1
N$68
  Top 0.3: U$22.G- arc-45 27.5,11.27 G$22.P$1
N$69
  Top 0.3: U$22.B- arc-45 26.27,12.5 B$22.P$1
N$70
  Top 0.3: U$23.R- arc-45 33.73,12.5 R$23.P$1
N$71
  Top 0.3: U$23.G- arc-45 32.5,11.27 G$23.P$1
N$72
  Top 0.3: U$23.B- arc-45 31.27,12.5 B$23.P$1
N$73
  Top 0.3: U$24.R- arc-45 38.73,12.5 R$24.P$1
N$74
  Top 0.3: U$24.G- arc-45 37.5,11.27 G$24.P$1
N$75
  Top 0.3: U$24.B- arc-45 36.27,12.5 B$24.P$1
N$76
  Top 0.3: U$25.R- arc-45 3.73,17.5 R$25.P$1
N$77
  Top 0.3: U$25.G- arc-45 2.5,16.27 G$25.P$1
N$78
  Top 0.3: U$25.B- arc-45 1.27,17.5 B$25.P$1
N$79
  Top 0.3: U$26.R- arc-45 8.73,17.5 R$26.P$1
N$80
  Top 0.3: U$26.G- arc-45 7.5,16.27 G$26.P$1
N$81
  Top 0.3: U$26.B- arc-45 6.27,17.5 B$26.P$1
N$82
  Top 0.3: U$27.R- arc-45 13.73,17.5 R$27.P$1
N$83
  Top 0.3: U$27.G- arc-45 12.5,16.27 G$27.P$1
N$84
  Top 0.3: U$27.B- arc-45 11.27,17.5 B$27.P$1
N$85
  Top 0.3: U$28.R- arc-45 18.73,17.5 R$28.P$1
N$86
  Top 0.3: U$28.G- arc-45 17.5,16.27 G$28.P$1
N$87
  Top 0.3: U$28.B- arc-45 16.27,17.5 B$28.P$1
N$88
  Top 0.3: U$29.R- arc-45 23.73,17.5 R$29.P$1
N$89
  Top 0.3: U$29.G- arc-45 22.5,16.27 G$29.P$1
N$90
  Top 0.3: U$29.B- arc-45 21.27,17.5 B$29.P$1
N$91
  Top 0.3: U$30.R- arc-45 28.73,17.5 R$30.P$1
N$92
  Top 0.3: U$30.G- arc-45 27.5,16.27 G$30.P$1
N$93
  Top 0.3: U$30.B- arc-45 26.27,17.5 B$30.P$1
N$94
  Top 0.3: U$31.R- arc-45 33.73,17.5 R$31.P$1
N$95
  Top 0.3: U$31.G- arc-45 32.5,16.27 G$31.P$1
N$96
  Top 0.3: U$31.B- arc-45 31.27,17.5 B$31.P$1
N$97
  Top 0.3: U$32.R- arc-45 38.73,17.5 R$32.P$1
N$98
  Top 0.3: U$32.G- arc-45 37.5,16.27 G$32.P$1
N$99
  Top 0.3: U$32.B- arc-45 36.27,17.5 B$32.P$1
N$100
  Top 0.3: U$33.R- arc-45 3.73,22.5 R$33.P$1
N$101
  Top 0.3: U$33.G- arc-45 2.5,21.27 G$33.P$1
N$102
  Top 0.3: U$33.B- arc-45 1.27,22.5 B$33.P$1
N$103
  Top 0.3: U$34.R- arc-45 8.73,22.5 R$34.P$1
N$104
  Top 0.3: U$34.G- arc-45 7.5,21.27 G$34.P$1
N$105
  Top 0.3: U$34.B- arc-45 6.27,22.5 B$34.P$1
N$106
  Top 0.3: U$35.R- arc-45 13.73,22.5 R$35.P$1
N$107
  Top 0.3: U$35.G- arc-45 12.5,21.27 G$35.P$1
N$108
  Top 0.3: U$35.B- arc-45 11.27,22.5 B$35.P$1
N$109
  Top 0.3: U$36.R- arc-45 18.73,22.5 R$36.P$1
N$110
  Top 0.3: U$36.G- arc-45 17.5,21.27 G$36.P$1
N$111
  Top 0.3: U$36.B- arc-45 16.27,22.5 B$36.P$1
N$112
  Top 0.3: U$38.R- arc-45 28.73,22.5 R$38.P$1
N$113
  Top 0.3: U$38.G- arc-45 27.5,21.27 G$38.P$1
N$114
  Top 0.3: U$38.B- arc-45 26.27,22.5 B$38.P$1
N$115
  Top 0.3: U$37.R- arc-45 23.73,22.5 R$37.P$1
N$116
  Top 0.3: U$37.G- arc-45 22.5,21.27 G$37.P$1
N$117
  Top 0.3: U$37.B- arc-45 21.27,22.5 B$37.P$1
N$118
  Top 0.3: U$39.R- arc-45 33.73,22.5 R$39.P$1
N$119
  Top 0.3: U$39.G- arc-45 32.5,21.27 G$39.P$1
N$120
  Top 0.3: U$39.B- arc-45 31.27,22.5 B$39.P$1
N$121
  Top 0.3: U$40.R- arc-45 38.73,22.5 R$40.P$1
N$122
  Top 0.3: U$40.G- arc-45 37.5,21.27 G$40.P$1
N$123
  Top 0.3: U$40.B- arc-45 36.27,22.5 B$40.P$1
N$124
  Top 0.3: U$41.R- arc-45 3.73,27.5 R$41.P$1
N$125
  Top 0.3: U$41.G- arc-45 2.5,26.27 G$41.P$1
N$126
  Top 0.3: U$41.B- arc-45 1.27,27.5 B$41.P$1
N$127
  Top 0.3: U$42.R- arc-45 8.73,27.5 R$42.P$1
N$128
  Top 0.3: U$42.G- arc-45 7.5,26.27 G$42.P$1
N$129
  Top 0.3: U$42.B- arc-45 6.27,27.5 B$42.P$1
N$130
  Top 0.3: U$44.R- arc-45 18.73,27.5 R$44.P$1
N$131
  Top 0.3: U$44.G- arc-45 17.5,26.27 G$44.P$1
N$132
  Top 0.3: U$44.B- arc-45 16.27,27.5 B$44.P$1
N$133
  Top 0.3: U$43.R- arc-45 13.73,27.5 R$43.P$1
N$134
  Top 0.3: U$43.G- arc-45 12.5,26.27 G$43.P$1
N$135
  Top 0.3: U$43.B- arc-45 11.27,27.5 B$43.P$1
N$136
  Top 0.3: U$45.R- arc-45 23.73,27.5 R$45.P$1
N$137
  Top 0.3: U$45.G- arc-45 22.5,26.27 G$45.P$1
N$138
  Top 0.3: U$45.B- arc-45 21.27,27.5 B$45.P$1
N$139
  Top 0.3: U$46.R- arc-45 28.73,27.5 R$46.P$1
N$140
  Top 0.3: U$46.G- arc-45 27.5,26.27 G$46.P$1
N$141
  Top 0.3: U$46.B- arc-45 26.27,27.5 B$46.P$1
N$142
  Top 0.3: U$47.R- arc-45 33.73,27.5 R$47.P$1
N$143
  Top 0.3: U$47.G- arc-45 32.5,26.27 G$47.P$1
N$144
  Top 0.3: U$47.B- arc-45 31.27,27.5 B$47.P$1
N$145
  Top 0.3: U$48.R- arc-45 38.73,27.5 R$48.P$1
N$146
  Top 0.3: U$48.G- arc-45 37.5,26.27 G$48.P$1
N$147
  Top 0.3: U$48.B- arc-45 36.27,27.5 B$48.P$1
N$148
  Top 0.3: U$50.R- arc-45 8.73,32.5 R$50.P$1
N$149
  Top 0.3: U$50.G- arc-45 7.5,31.27 G$50.P$1
N$150
  Top 0.3: U$50.B- arc-45 6.27,32.5 B$50.P$1
N$151
  Top 0.3: U$49.R- arc-45 3.73,32.5 R$49.P$1
N$152
  Top 0.3: U$49.G- arc-45 2.5,31.27 G$49.P$1
N$153
  Top 0.3: U$49.B- arc-45 1.27,32.5 B$49.P$1
N$154
  Top 0.3: U$51.R- arc-45 13.73,32.5 R$51.P$1
N$155
  Top 0.3: U$51.G- arc-45 12.5,31.27 G$51.P$1
N$156
  Top 0.3: U$51.B- arc-45 11.27,32.5 B$51.P$1
N$157
  Top 0.3: U$53.R- arc-45 23.73,32.5 R$53.P$1
N$158
  Top 0.3: U$53.G- arc-45 22.5,31.27 G$53.P$1
N$159
  Top 0.3: U$53.B- arc-45 21.27,32.5 B$53.P$1
N$160
  Top 0.3: U$52.R- arc-45 18.73,32.5 R$52.P$1
N$161
  Top 0.3: U$52.G- arc-45 17.5,31.27 G$52.P$1
N$162
  Top 0.3: U$52.B- arc-45 16.27,32.5 B$52.P$1
N$163
  Top 0.3: U$54.R- arc-45 28.73,32.5 R$54.P$1
N$164
  Top 0.3: U$54.G- arc-45 27.5,31.27 G$54.P$1
N$165
  Top 0.3: U$54.B- arc-45 26.27,32.5 B$54.P$1
N$166
  Top 0.3: U$55.R- arc-45 33.73,32.5 R$55.P$1
N$167
  Top 0.3: U$55.G- arc-45 32.5,31.27 G$55.P$1
N$168
  Top 0.3: U$55.B- arc-45 31.27,32.5 B$55.P$1
N$169
  Top 0.3: U$56.R- arc-45 38.73,32.5 R$56.P$1
N$170
  Top 0.3: U$56.G- arc-45 37.5,31.27 G$56.P$1
N$171
  Top 0.3: U$56.B- arc-45 36.27,32.5 B$56.P$1
N$172
  Top 0.3: U$58.R- arc-45 8.73,37.5 R$58.P$1
N$173
  Top 0.3: U$58.G- arc-45 7.5,36.27 G$58.P$1
N$174
  Top 0.3: U$58.B- arc-45 6.27,37.5 B$58.P$1
N$175
  Top 0.3: U$57.R- arc-45 3.73,37.5 R$57.P$1
N$176
  Top 0.3: U$57.G- arc-45 2.5,36.27 G$57.P$1
N$177
  Top 0.3: U$57.B- arc-45 1.27,37.5 B$57.P$1
N$178
  Top 0.3: U$59.R- arc-45 13.73,37.5 R$59.P$1
N$179
  Top 0.3: U$59.G- arc-45 12.5,36.27 G$59.P$1
N$180
  Top 0.3: U$59.B- arc-45 11.27,37.5 B$59.P$1
N$181
  Top 0.3: U$60.R- arc-45 18.73,37.5 R$60.P$1
N$182
  Top 0.3: U$60.G- arc-45 17.5,36.27 G$60.P$1
N$183
  Top 0.3: U$60.B- arc-45 16.27,37.5 B$60.P$1
N$184
  Top 0.3: U$61.R- arc-45 23.73,37.5 R$61.P$1
N$185
  Top 0.3: U$61.G- arc-45 22.5,36.27 G$61.P$1
N$186
  Top 0.3: U$61.B- arc-45 21.27,37.5 B$61.P$1
N$187
  Top 0.3: U$62.R- arc-45 28.73,37.5 R$62.P$1
N$188
  Top 0.3: U$62.G- arc-45 27.5,36.27 G$62.P$1
N$189
  Top 0.3: U$62.B- arc-45 26.27,37.5 B$62.P$1
N$190
  Top 0.3: U$63.R- arc-45 33.73,37.5 R$63.P$1
N$191
  Top 0.3: U$63.G- arc-45 32.5,36.27 G$63.P$1
N$192
  Top 0.3: U$63.B- arc-45 31.27,37.5 B$63.P$1
N$193
  Top 0.3: U$64.R- arc-45 38.73,37.5 R$64.P$1
N$194
  Top 0.3: U$64.G- arc-45 37.5,36.27 G$64.P$1
N$195
  Top 0.3: U$64.B- arc-45 36.27,37.5 B$64.P$1